# EAGLE design untitled (EAGLE 5.11)
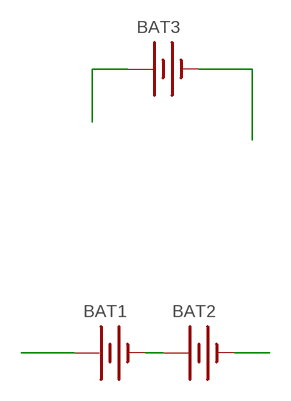
[diagram p0: schematic, sheet 1]

## Parts
BAT1  BATTERYCR123A  [BATTERY_CR123A]
BAT2  BATTERYCR123A  [BATTERY_CR123A]
BAT3  BATTERYCR123A  [BATTERY_CR123A]

## Nets
N$1: BAT1.- BAT2.+
N$4: BAT3.+
N$6: BAT3.-
N$7: BAT1.+
N$8: BAT2.-

## Library data of the parts
BAT1-BAT3 = tvbgone-adj:BATTERY: Battery Holders Various common sizes : AA, AAA, 20mm coin cell and 12mm coin cell.

## Board
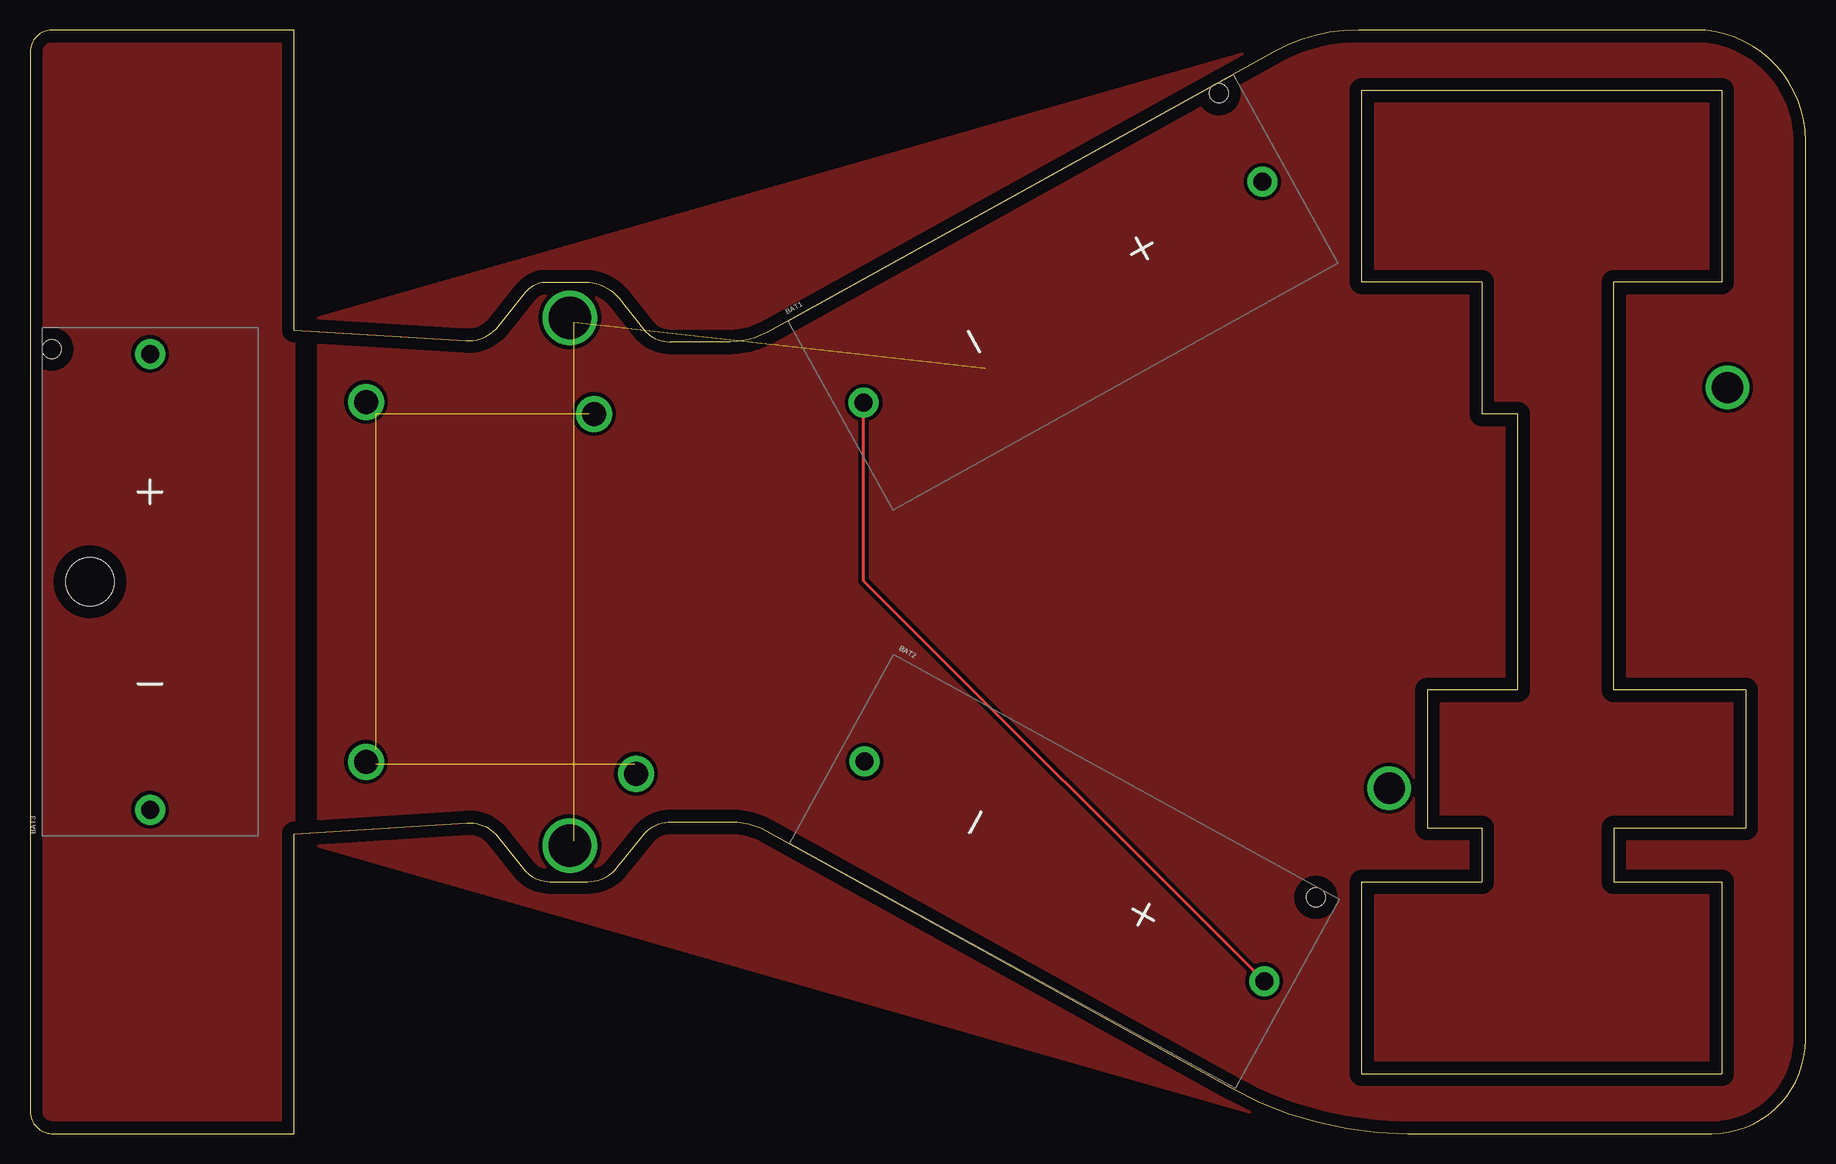
[diagram p1: board, top side]
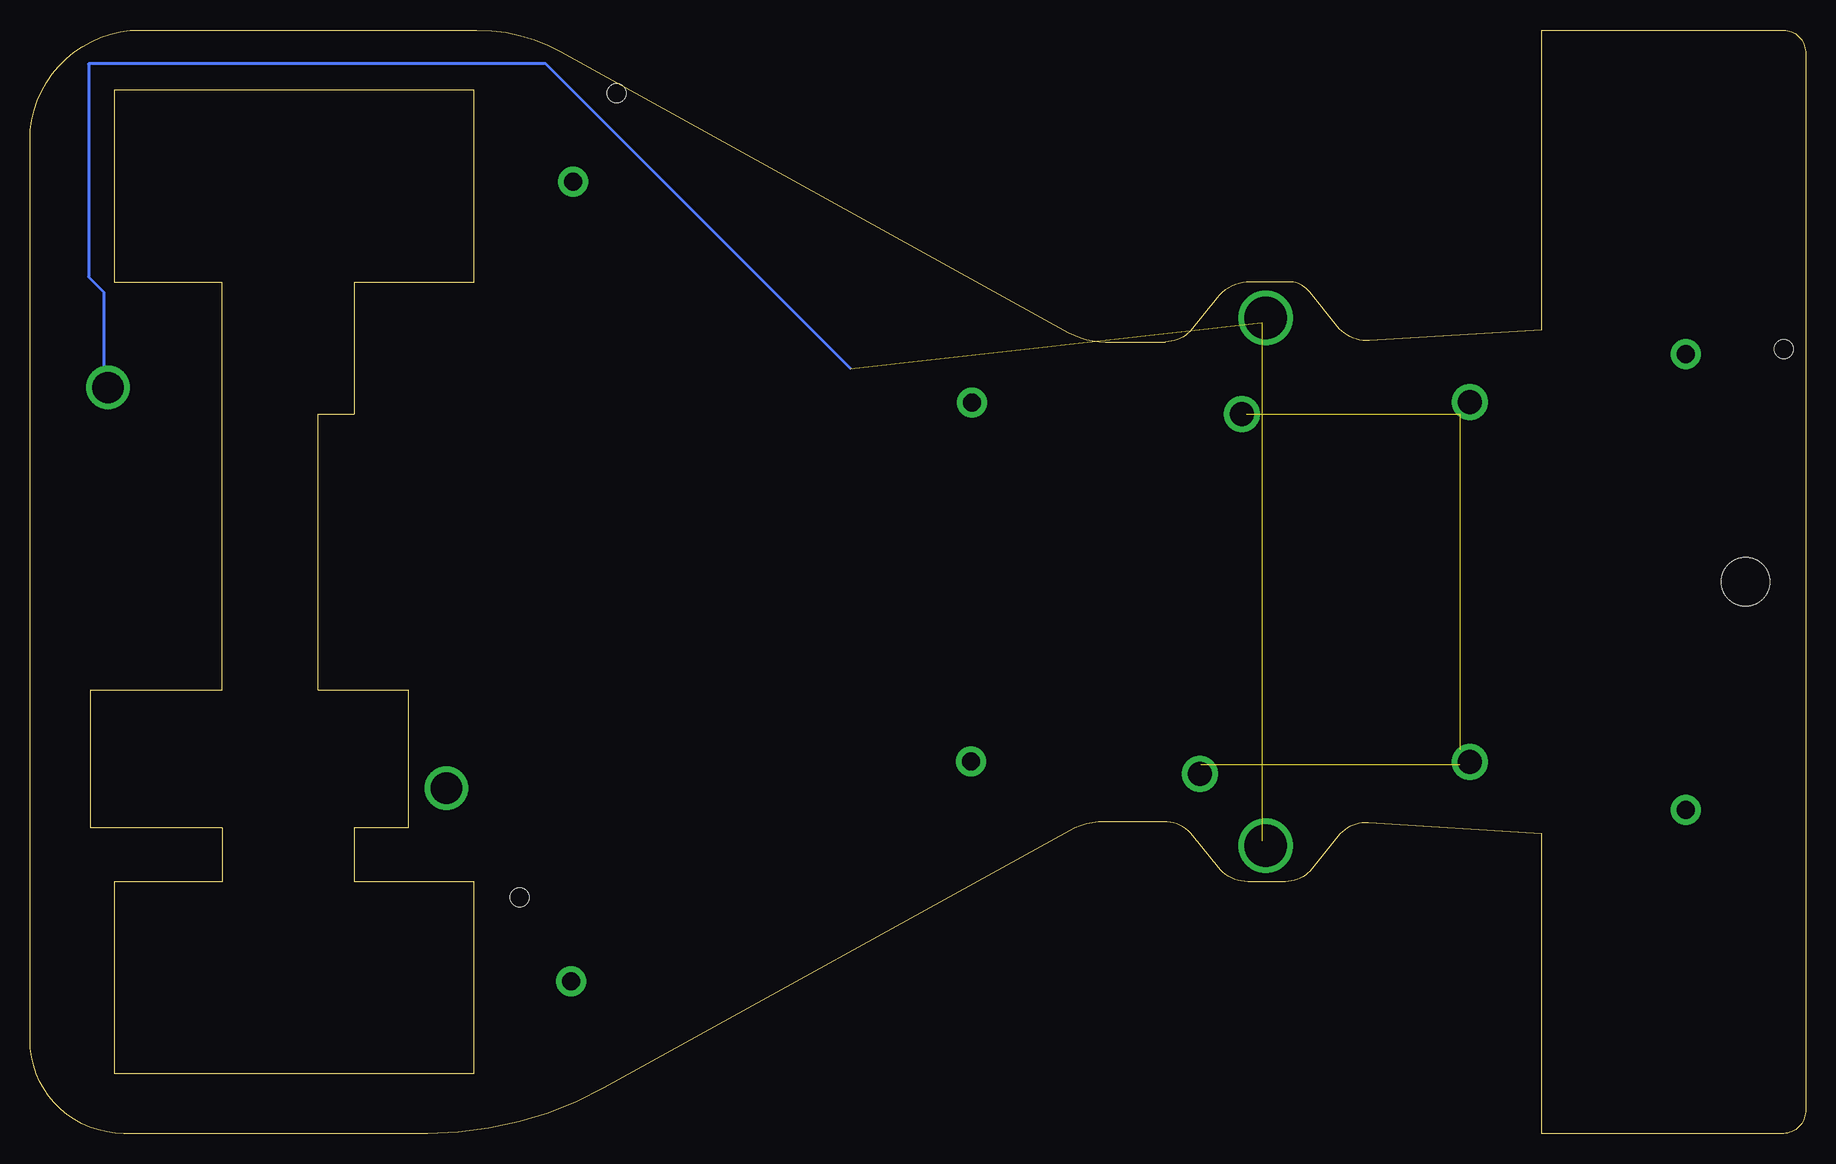
[diagram p2: board, bottom side, seen from below]

Size 148 x 92 mm. Coordinates in mm from the lower left corner, seen from the top.
Outline: 111,5 111,21 121,21 121,25.5 116.49,25.5 116.49,37 124,37 124,60 121,60 121,71 111,71 111,87 141,87 141,71 132,71 132,37 143,37 143,25.5 132,25.5 132,21 141,21 141,5 111,5
Outline: 22,67 36.36,66.1 arc55 39.03,67.29 41.33,70.16 arc-51 43.08,71 46.27,71 arc-51 49.08,69.65 51.15,67.06 arc51 53.36,66 58.37,66 arc29 61.43,66.79 103.71,90.18 arc-29 110.76,92 138.78,92 arc-90 148,82.78 148,7.81 arc-90 140.19,0 114.85,0 arc-29 100.13,3.8 61.38,25.24 arc29 58.43,26 53.52,26 arc51 51.05,24.82 48.95,22.19 arc-51 46.48,21 43.36,21 arc-51 41.15,22.06 38.98,24.79 arc55 36.45,25.91 22,25 22,0 2,0 arc-97 0,2 0,90 arc-97 2,92 22,92 22,67
Copper layers (1*16): Top 0.035mm / dielectric 1.5mm / Bottom 0.035mm
Design rules "default": minimum track width 10mil, minimum drill 24mil, track to track 8mil, track to pad 8mil, pad to pad 8mil, via to via 8mil, smd to smd 8mil, copper to edge 40mil, drill to drill 8mil, minimum pad ring 10mil, minimum via ring 8mil, stop-mask expansion 4mil, vias tented up to drill 0mil, thermal gap 10mil
Holes 4 mm at 5,46

### Footprints (pad centres in the part's own frame; a part is rotated, then mirrored left to right if it is on the bottom)
BATTERY_CR123A = drill 1.5 pad 2.5 round: + 19,0; - -19,0 | hole 1.575: 19.4,8.2

### Placement (x,y rotation side)
BAT1  86.11,70.15 29 top
BAT2  86.23,21.86 331.2 top
BAT3  10,46 90 top

### Tracks (layer width: path | path; a pad name or v marks a point on that pad's centre or on a via)
GND
  pour Top (isolate 0.305): 108,92 24,68 24,24 108,0 140.19,0 arc90 148,7.81 148,82.78 arc90 138.78,92
N$1
  Top 0.254: BAT2.+ 69.5,46.09 BAT1.-
N$2  (via drill 2.6)
  other vias: 113.3,28.8
N$3  (via drill 2.6, 3.56)  (2 unrouted)
  Bottom 0.254: 79.62,63.78 105.02,89.18 143.12,89.18 143.12,71.4 141.85,70.13 141.85,62.51 v141.5,62.2 | v45,68 45.33,67.59 | v45,24 45.33,24.41
N$5  (via drill 2)  (3 unrouted)
  Bottom 0.254: v47,60 46.6,59.97 | 28.82,30.76 v28,31 28.82,32.03 | v50.5,30 50.41,30.76 | v28,61 28.82,59.97
N$9
  pour Top (isolate 0.305): 0,92 0,0 22,0 22,92